# EAGLE schematic har_DAA_PMIC_Programming (EAGLE 7.6.0)
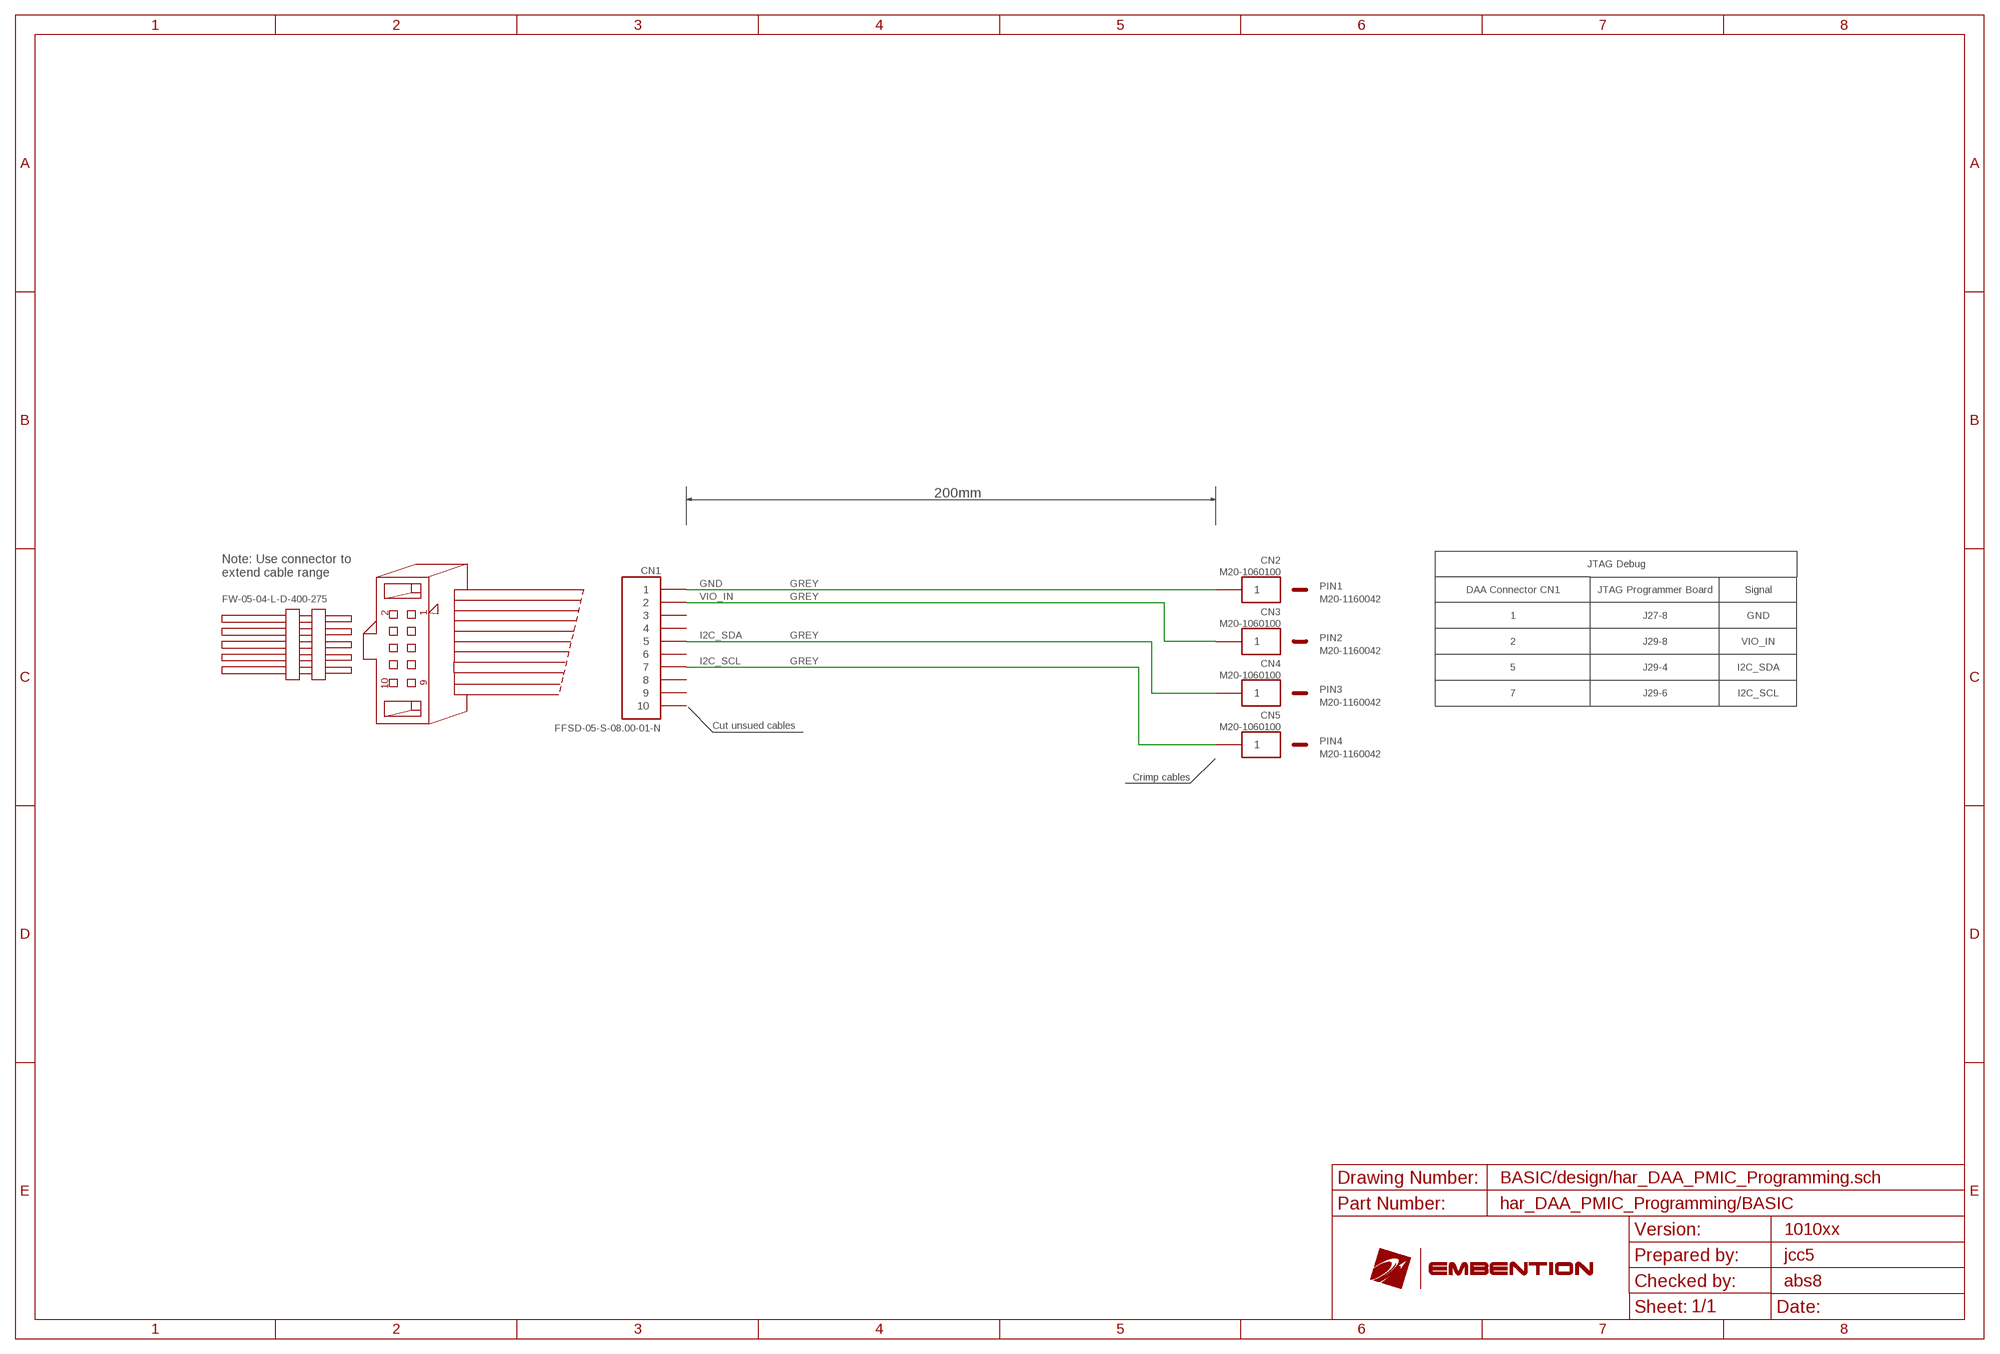
[diagram p0: schematic, sheet 1]

## Parts
CN1  FFSD-05-S-08.00-01-N  10-PIN-NUM  [25-PIN]
CN2  M20-1060100  1-PIN-NUM  [2-PIN]
CN3  M20-1060100  1-PIN-NUM  [2-PIN]
CN4  M20-1060100  1-PIN-NUM  [2-PIN]
CN5  M20-1060100  1-PIN-NUM  [2-PIN]
CN6  FW-05-04-L-D-400-275  0-PIN  [CLAMP]
PIN1  M20-1160042  CONN-PIN  [1-PIN]
PIN2  M20-1160042  CONN-PIN  [1-PIN]
PIN3  M20-1160042  CONN-PIN  [1-PIN]
PIN4  M20-1160042  CONN-PIN  [1-PIN]

## Nets
GND: CN1.P$1 CN2.P$1
I2C_SCL: CN1.P$7 CN5.P$1
I2C_SDA: CN1.P$5 CN4.P$1
VIO_IN: CN1.P$2 CN3.P$1
Unconnected: CN1.P$3 CN1.P$4 CN1.P$6 CN1.P$8 CN1.P$9 CN1.P$10 PIN1.P$1 PIN2.P$1 PIN3.P$1 PIN4.P$1

## Notes on the sheet
- 200mm
- JTAG Debug
- Note: Use connector to
  extend cable range
- GREY | DAA Connector CN1 | JTAG Programmer Board | Signal
- GREY
- 2 | 1 | 1 | J27-8 | GND
- GREY | 2 | J29-8 | VIO_IN
- GREY | 5 | J29-4 | I2C_SDA
- 9
- 10
- 7 | J29-6 | I2C_SCL
- Cut unsued cables
- Crimp cables
- BASIC/design/har_DAA_PMIC_Programming.sch
- har_DAA_PMIC_Programming/BASIC
- 1010xx
- jcc5
- abs8

## Library data of the parts
CN1 = emb-har-Connectors:10-PIN-NUM; PNS: HAR-WIRE-FFSD-05-S-08.00-01-N.pns
CN2-CN5 = emb-har-Connectors:1-PIN-NUM; PNS: HAR-CONN-M20-1060100.pns
CN6 = emb-har-Connectors:0-PIN; PNS: CONN-FW-05-04-L-D-400-275.pns
PIN1-PIN4 = emb-har-Electrical_Terminations:CONN-PIN; PNS: HAR-TERM-M20-1160042.pns

## Net classes
1 600V: width 1 mm, clearance 2 mm